# EAGLE schematic m1-mainboad (EAGLE 9.5.1)
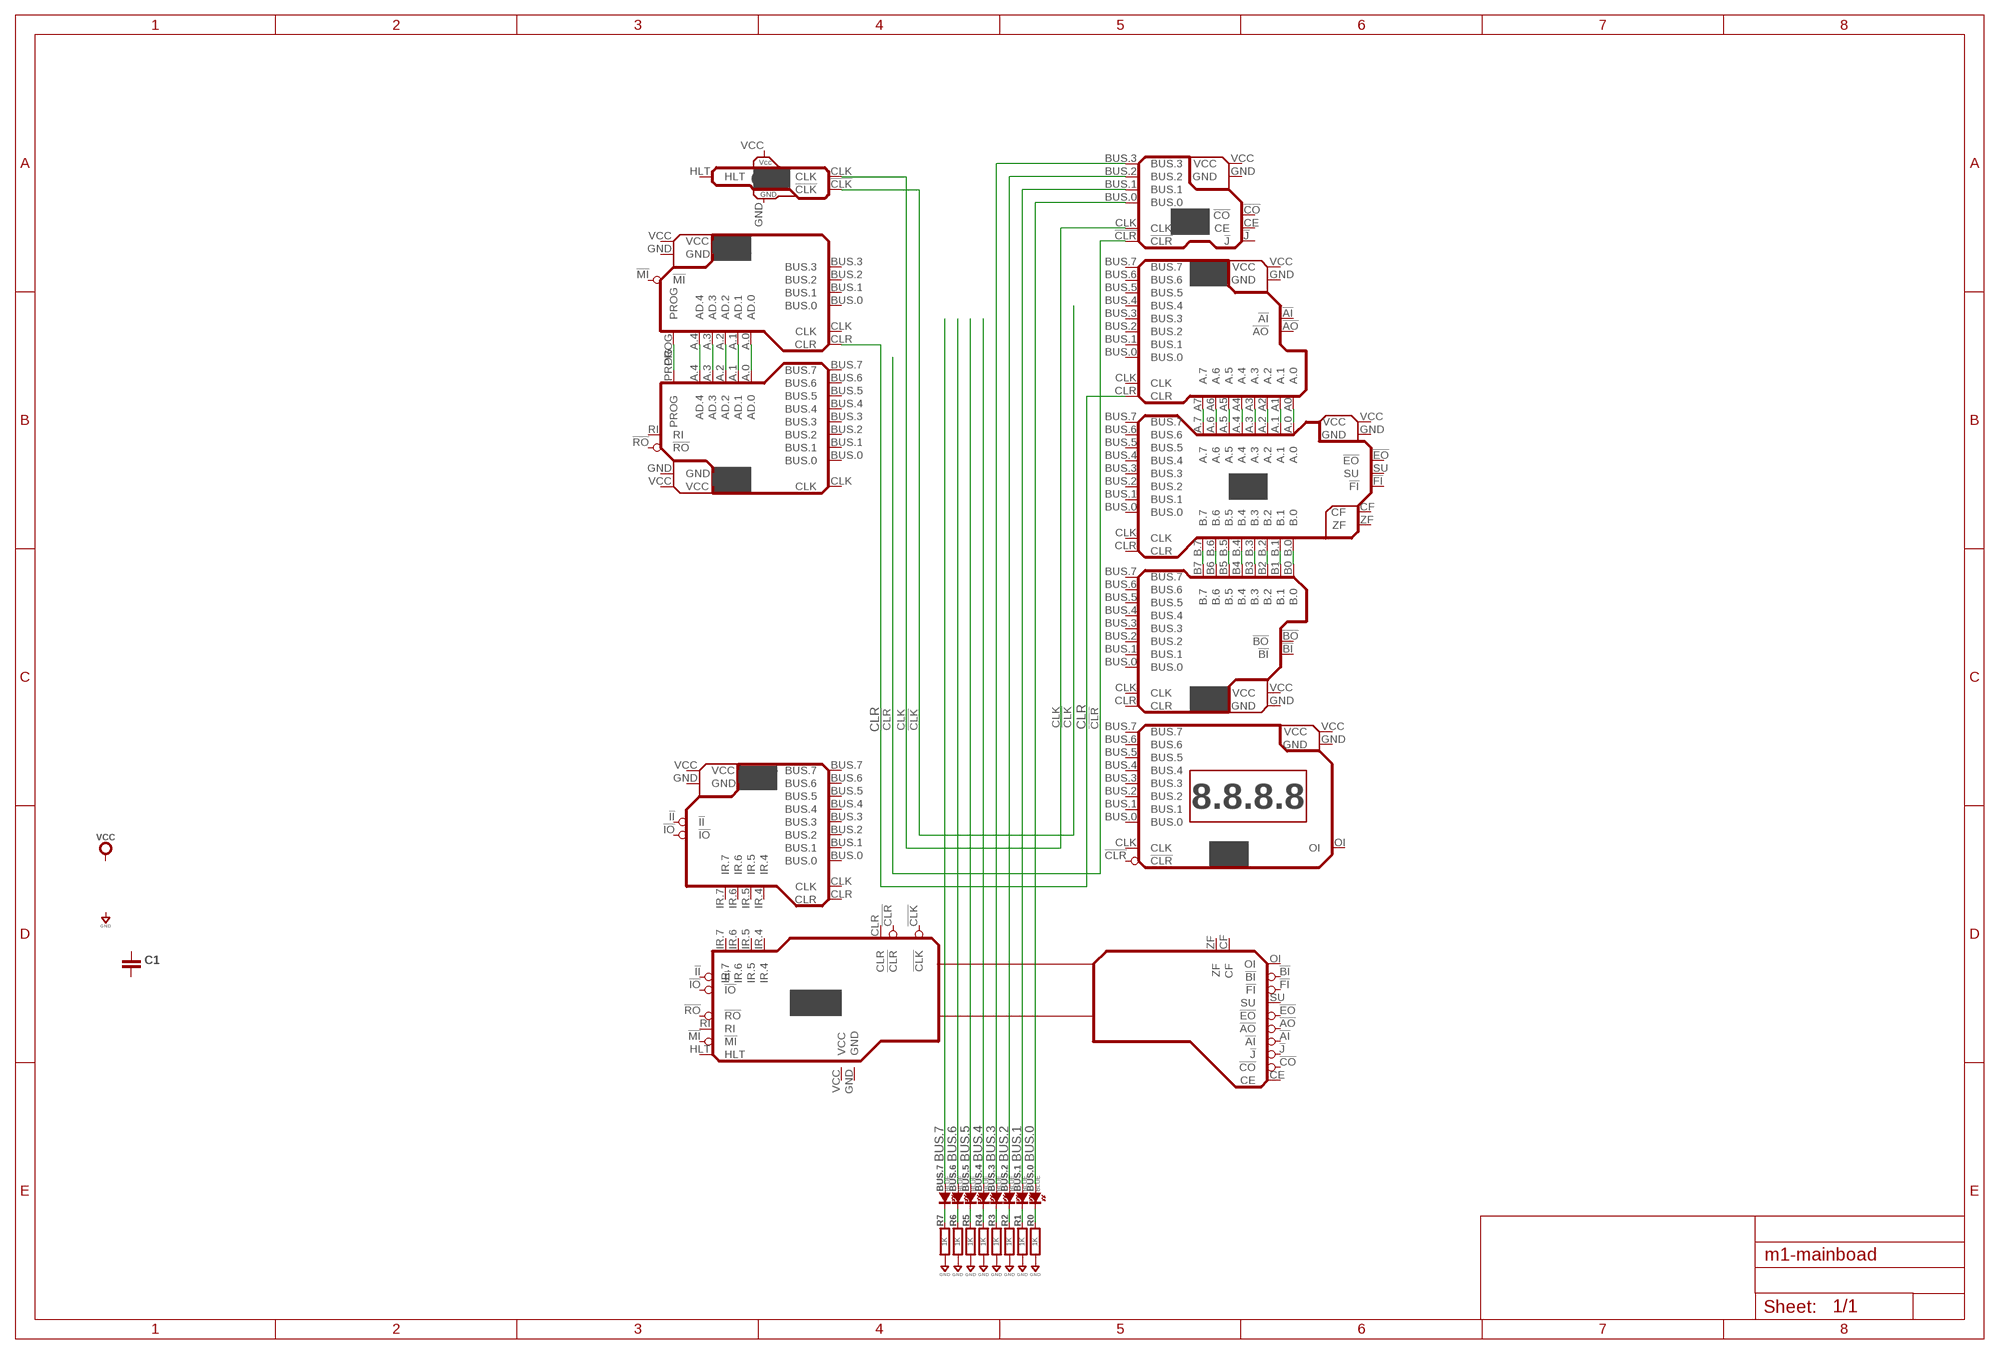
[diagram p0: schematic, sheet 1]

## Parts
A  M1-REG-A-REV-A  [M1-REG-A]
ALU  M1-ALU-REV-A  [M1-ALU]
B  M1-REG-B-REV-A  [M1-REG-B]
BUS.0  BLUE  SMT0603  [SMD_0603]
BUS.1  BLUE  SMT0603  [SMD_0603]
BUS.2  BLUE  SMT0603  [SMD_0603]
BUS.3  BLUE  SMT0603  [SMD_0603]
BUS.4  BLUE  SMT0603  [SMD_0603]
BUS.5  BLUE  SMT0603  [SMD_0603]
BUS.6  BLUE  SMT0603  [SMD_0603]
BUS.7  BLUE  SMT0603  [SMD_0603]
C1  CAPACITOR0603  [0603-CAP]
CLK  M1-CLOCKREV-A  [M1-CLOCK]
CTRL  M1-CONTROL-REV-A  [M1-CONTROL]
INST  M1-REG-INSTR-REV-A  [M1-REG-I]
MAR  M1-MAR-REV-A  [M1-MAR]
OUT  M1-REG-OUTPUT-REV-A  [M1-REG-OUTPUT]
PC1  M1-PROG-COUNTERREV-A  [M1-PROGRAM-COUNTER]
R0  1K  RESISTOR0603  [0603-RES]
R1  1K  RESISTOR0603  [0603-RES]
R2  1K  RESISTOR0603  [0603-RES]
R3  1K  RESISTOR0603  [0603-RES]
R4  1K  RESISTOR0603  [0603-RES]
R5  1K  RESISTOR0603  [0603-RES]
R6  1K  RESISTOR0603  [0603-RES]
R7  1K  RESISTOR0603  [0603-RES]
RAM  M1-RAM-REV-A  [M1-RAM]

## Nets
!CLK: CLK.!CLK
!CLR: PC1.!CLR
BUS.0: BUS.0.A PC1.BUS.0
BUS.1: BUS.1.A PC1.BUS.1
BUS.2: BUS.2.A PC1.BUS.2
BUS.3: BUS.3.A PC1.BUS.3
BUS.4: BUS.4.A
BUS.5: BUS.5.A
BUS.6: BUS.6.A
BUS.7: BUS.7.A
CLK: CLK.CLK PC1.CLK
CLR: A.CLR MAR.CLR
GND: R0.1 R1.1 R2.1 R3.1 R4.1 R5.1 R6.1 R7.1
N$1: BUS.0.K(C) R0.2
N$2: BUS.1.K(C) R1.2
N$3: BUS.2.K(C) R2.2
N$4: BUS.3.K(C) R3.2
N$5: BUS.4.K(C) R4.2
N$6: BUS.5.K(C) R5.2
N$7: BUS.6.K(C) R6.2
N$8: BUS.7.K(C) R7.2
N$9: A.A4(A.4) ALU.A.4
N$10: A.A5(A.5) ALU.A.5
N$11: A.A6(A.6) ALU.A.6
N$12: A.A7(A.7) ALU.A.7
N$13: A.A3(A.3) ALU.A.3
N$14: A.A2(A.2) ALU.A.2
N$15: A.A1(A.1) ALU.A.1
N$16: A.A0(A.0) ALU.A.0
N$17: ALU.B.4 B.B4(B.4)
N$18: ALU.B.5 B.B5(B.5)
N$19: ALU.B.6 B.B6(B.6)
N$20: ALU.B.7 B.B7(B.7)
N$21: ALU.B.3 B.B3(B.3)
N$22: ALU.B.2 B.B2(B.2)
N$23: ALU.B.1 B.B1(B.1)
N$24: ALU.B.0 B.B0(B.0)
N$25: MAR.A.0(AD.0) RAM.A.0(AD.0)
N$26: MAR.A.1(AD.1) RAM.A.1(AD.1)
N$27: MAR.A.2(AD.2) RAM.A.2(AD.2)
N$28: MAR.A.3(AD.3) RAM.A.3(AD.3)
N$29: MAR.A.4(AD.4) RAM.A.4(AD.4)
N$30: MAR.PROG RAM.PROG
Unconnected: A.!AI A.!AO A.BUS.0 A.BUS.1 A.BUS.2 A.BUS.3 A.BUS.4 A.BUS.5 A.BUS.6 A.BUS.7 A.CLK ALU.!EO ALU.!FI ALU.BUS.0 ALU.BUS.1 ALU.BUS.2 ALU.BUS.3 ALU.BUS.4 ALU.BUS.5 ALU.BUS.6 ALU.BUS.7 ALU.CF ALU.CLK ALU.CLR ALU.SU ALU.ZF B.!BI B.!BO B.BUS.0 B.BUS.1 B.BUS.2 B.BUS.3 B.BUS.4 B.BUS.5 B.BUS.6 B.BUS.7 B.CLK B.CLR C1.1 C1.2 CLK.HLT CTRL.!AI CTRL.!AO CTRL.!BI CTRL.!CLK CTRL.!CLR CTRL.!CO CTRL.!EO CTRL.!FI CTRL.!II CTRL.!IO CTRL.!J CTRL.!MI CTRL.!RO CTRL.CE CTRL.CF CTRL.CLR CTRL.HLT CTRL.IR.4 CTRL.IR.5 CTRL.IR.6 CTRL.IR.7 CTRL.OI CTRL.RI CTRL.SU CTRL.ZF INST.!II INST.!IO INST.BUS.0 INST.BUS.1 INST.BUS.2 INST.BUS.3 INST.BUS.4 INST.BUS.5 INST.BUS.6 INST.BUS.7 INST.CLK INST.CLR INST.IR.4 INST.IR.5 INST.IR.6 INST.IR.7 MAR.!MI MAR.BUS.0 MAR.BUS.1 MAR.BUS.2 MAR.BUS.3 MAR.CLK OUT.!CLR OUT.BUS.0 OUT.BUS.1 OUT.BUS.2 OUT.BUS.3 OUT.BUS.4 OUT.BUS.5 OUT.BUS.6 OUT.BUS.7 OUT.CLK OUT.OI PC1.!CO PC1.!J PC1.CE RAM.!RO RAM.BUS.0 RAM.BUS.1 RAM.BUS.2 RAM.BUS.3 RAM.BUS.4 RAM.BUS.5 RAM.BUS.6 RAM.BUS.7 RAM.CLK RAM.RI

## Power pins joined to a net without a drawn wire
GND: A.GND ALU.GND B.GND CLK.GND CTRL.GND INST.GND MAR.GND OUT.GND PC1.GND RAM.GND
VCC: A.VCC ALU.VCC B.VCC CLK.VCC CTRL.VCC INST.VCC MAR.VCC OUT.VCC PC1.VCC RAM.VCC

## Library data of the parts
A = circuitmonkey-m1-computer:M1-REG-A: M1 Register A
ALU = circuitmonkey-m1-computer:M1-ALU: M1 - ALU
B = circuitmonkey-m1-computer:M1-REG-B
BUS.0 BUS.1-BUS.7 = led:SMT: LED SMT
C1 = rlc:CAPACITOR: Capacitor CAP
CLK = circuitmonkey-m1-computer:M1-CLOCK: M1 Clock Module
CTRL = circuitmonkey-m1-computer:M1-CONTROL: M1 - Control Logic (CTRL)
INST = circuitmonkey-m1-computer:M1-REG-INSTR: M1 - Instruction Register (IR)
MAR = circuitmonkey-m1-computer:M1-MAR: M1 - MAR
OUT = circuitmonkey-m1-computer:M1-REG-OUTPUT: M1 - Output Register
PC1 = circuitmonkey-m1-computer:M1-PROG-COUNTER: M1 Program Counter
R0 R1-R7 = rlc:RESISTOR: Resistor
RAM = circuitmonkey-m1-computer:M1-RAM